# Altium schematic sheet LCD4.3.SchDoc: LCD4.3
size A4; CompanyName: STMicroelectronics; Organization: Microcontrollers Division; DocumentNumber: 16; SheetNumber: 12; SheetTotal: 19
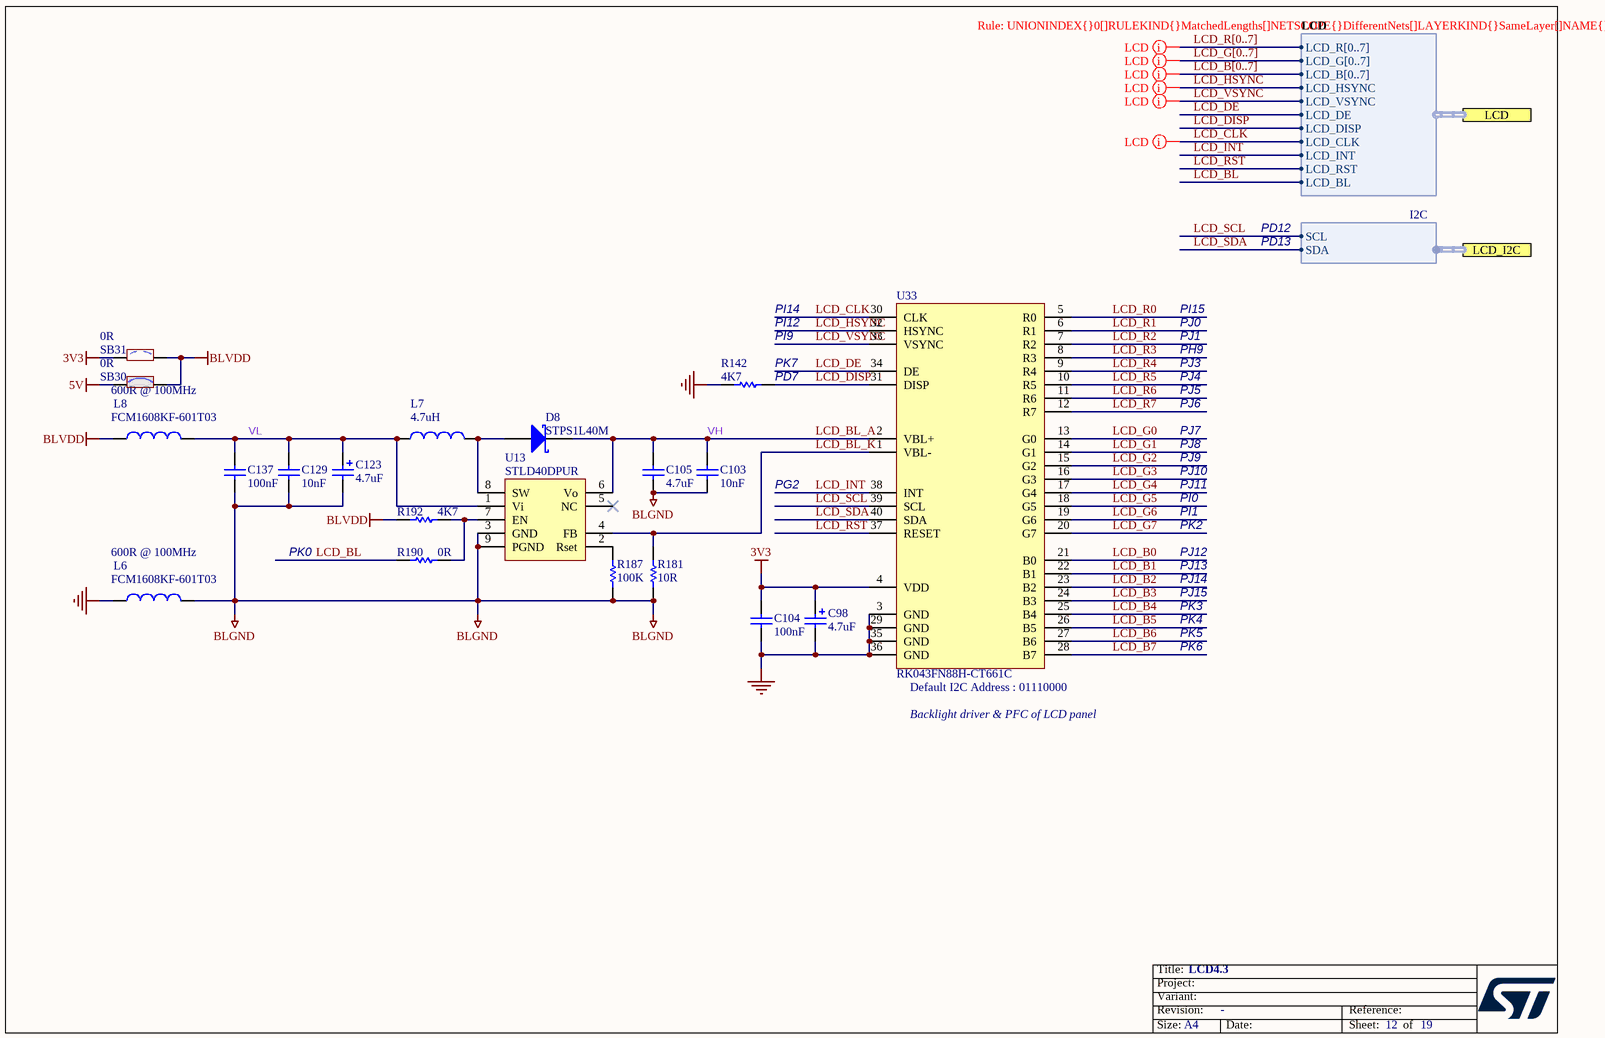
[diagram p0: LCD4.3.SchDoc]

## Parts
C98  value 4.7uF  [CPOL_VISHAY_TANTAL-595D_1407_H220]  (hidden comment: Cap_POL_TANA)
C103  value 10nF  [C0603]  (hidden comment: Capacitor)
C104  value 100nF  [C0402]  (hidden comment: Capacitor)
C105  value 4.7uF  [C1206_H1P25]  (hidden comment: Capacitor)
C123  value 4.7uF  [CPOL_VISHAY_TANTAL-595D_1407_H220]  (hidden comment: Cap_POL_TANA)
C129  value 10nF  [C0603]  (hidden comment: Capacitor)
C137  value 100nF  [C0402]  (hidden comment: Capacitor)
D8  STPS1L40M  [DIO_DO216-AA]
L6  value 600R @ 100MHz  Manufacturer_Part_Number: FCM1608KF-601T03  [L0603]  (hidden comment: BEAD)
L7  value 4.7uH  [L1210_LQH]  (hidden comment: Inductor)
L8  value 600R @ 100MHz  Manufacturer_Part_Number: FCM1608KF-601T03  [L0603]  (hidden comment: BEAD)
R142  value 4K7  [R0603]  (hidden comment: Resistor)
R181  value 10R  [R0805]  (hidden comment: Resistor)
R187  value 100K  [R0402]  (hidden comment: Resistor)
R190  value 0R  [R0603]  (hidden comment: Resistor)
R192  value 4K7  [R0603]  (hidden comment: Resistor)
SB30  value 0R  [SOLDER-BRIDGE_R0603-0R]  (hidden comment: SB_ON)
SB31  value 0R  [SOLDER-BRIDGE_R0603-0R]  (hidden comment: SB_OFF)
U13  STLD40DPUR  [ICC_QFN8-EPAD_3X3_P065]
U33  RK043FN88H-CT661C  [LCD_ROCKTEK_RK043FN48H-CT672B_40P_P080_FLEX-FOLDED]

## Ports
LCD (harness LCD), LCD_I2C (harness I2C)

## Harnesses
LCD: LCD_R[0..7], LCD_G[0..7], LCD_B[0..7], LCD_HSYNC, LCD_VSYNC, LCD_DE, LCD_DISP, LCD_CLK, LCD_INT, LCD_BL, LCD_RST
I2C: SDA, SCL

## Nets
3V3: C98.1 C104.2 SB31.1 U33.4(VDD)
5V: SB30.1
BLGND: C103.1 C105.1 C123.2 C129.1 C137.1 L6.2 R181.1 R187.1 U13.3(GND) U13.9(PGND)
BLVDD: L8.1 R192.1 SB30.2 SB31.2
GND: C98.2 C104.1 L6.1 R142.1 U33.3(GND) U33.29(GND) U33.35(GND) U33.36(GND)
LCD_B0: U33.21(B0)
LCD_B1: U33.22(B1)
LCD_B2: U33.23(B2)
LCD_B3: U33.24(B3)
LCD_B4: U33.25(B4)
LCD_B5: U33.26(B5)
LCD_B6: U33.27(B6)
LCD_B7: U33.28(B7)
LCD_BL: R190.1 ; port LCD.LCD_BL
LCD_BL_A: C103.2 C105.2 D8.2(K) U13.6(Vo) U33.2(VBL+)  [also labelled VH]
LCD_BL_K: R181.2 U13.4(FB) U33.1(VBL-)
LCD_CLK: U33.30(CLK) ; port LCD.LCD_CLK
LCD_DE: U33.34(DE) ; port LCD.LCD_DE
LCD_DISP: R142.2 U33.31(DISP) ; port LCD.LCD_DISP
LCD_G0: U33.13(G0)
LCD_G1: U33.14(G1)
LCD_G2: U33.15(G2)
LCD_G3: U33.16(G3)
LCD_G4: U33.17(G4)
LCD_G5: U33.18(G5)
LCD_G6: U33.19(G6)
LCD_G7: U33.20(G7)
LCD_HSYNC: U33.32(HSYNC) ; port LCD.LCD_HSYNC
LCD_INT: U33.38(INT) ; port LCD.LCD_INT
LCD_R0: U33.5(R0)
LCD_R1: U33.6(R1)
LCD_R2: U33.7(R2)
LCD_R3: U33.8(R3)
LCD_R4: U33.9(R4)
LCD_R5: U33.10(R5)
LCD_R6: U33.11(R6)
LCD_R7: U33.12(R7)
LCD_RST: U33.37(RESET) ; port LCD.LCD_RST
LCD_SCL: U33.39(SCL) ; port LCD_I2C.SCL
LCD_SDA: U33.40(SDA) ; port LCD_I2C.SDA
LCD_VSYNC: U33.33(VSYNC) ; port LCD.LCD_VSYNC
VL: C123.1 C129.2 C137.2 L7.1 L8.2 U13.1(Vi)
NetD8_1: D8.1(A) L7.2 U13.8(SW)
NetR187_2: R187.2 U13.2(Rset)
NetR190_2: R190.2 R192.2 U13.7(EN)

Not connected (* = marked no-connect by the designer): U13 5(NC)*

## Buses and harness runs
bus LCD_B[0..7]
bus LCD_G[0..7]
bus LCD_R[0..7]

## Layout directives
rule Matched Net Lengths [Tolerance = 100mil]: (no net found under the mark), LCD_CLK, LCD_HSYNC, LCD_VSYNC

## Notes on the sheet
- PD13
- PD12
- PI14
- PI15
- (near R142) PI9
- PI12
- (near R142) PD7
- (near R142) PK7
- PJ0
- PJ1
- PH9
- PJ3
- PJ4
- PJ5
- PJ6
- PJ7
- PJ8
- PG2
- PJ9
- PJ10
- PJ11
- PI0
- PI1
- PK0
- PK2
- PJ12
- PJ13
- PJ14
- PJ15
- PK3
- PK4
- PK5
- PK6
- Backlight driver & PFC of LCD panel
- (near U33) Default I2C Address : 01110000
- Title:
- Project:
- Size:
- Revision:
- Variant:
- A4
- -
- Date:
- Reference:
- Sheet:
- of

## Library data of the parts
C98 C123 = MCD-00595: Capacitor, Tantalum, 4.7uF, 16V, +/-10%, 595D case A; Manufacturer_Part_Number: 595D475X9016A2T; Manufacturer: VISHAY; Part_Preference: Recommended; Order_Code_RS: 117-303; Provided_By: Subcon; Initial_Board_Reference: MB1331; Component_Country_Of_Origin: Israel; ID: 3146; ShowFields: YES; Revision: July-2002: Re-released for DXP Platform.; Internal_Part_Number: MCD-00595; Status: Released; Part_Type: Capacitor; ComponentLink1Description: VISHAY_CAPACITOR_TANTALUM_595D.pdf; ComponentLink1URL: http://tunmcdsvn.tun.st.com/Component_Documentation_Library/Trunk/Capacitor/VISHAY_595D_Series; Order_Code_Digikey: 595D475X9016A2T-ND; Order_Code_Farnell: 1166805; Package: 3718 (metric)
C103 C129 = MCD-00017: Capacitor, MLCC, 10nF, 50V, X7R, +/-10%, 0603, T=0.8mm; Manufacturer_Part_Number: CC0603KRX7R9BB103; Manufacturer: YAGEO; Part_Preference: Recommended; Component_Country_Of_Origin: China; ID: 2500; Order_Code_RS: 722236; ShowFields: YES; Internal_Part_Number: MCD-00017; Status: Released; Part_Type: Capacitor; Package: 0603; ComponentLink1URL: http://tunmcdsvn.tun.st.com/Component_Documentation_Library/Trunk/Capacitor/YAGEO_X7R_Series; Order_Code_Digikey: 311-1085-1-ND; Order_Code_Farnell: 722236
C104 C137 = MCD-00006: Capacitor, MLCC, 100nF, 16V, X7R, +/-10%, 0402, T=0.5mm; Manufacturer_Part_Number: CC0402KRX7R7BB104; Manufacturer: YAGEO; Part_Preference: Recommended; Partial_Alternate_Internal_Part_Number: MCD-03299; Component_Country_Of_Origin: China; ID: 2474; Order_Code_RS: 9402047; ShowFields: YES; Internal_Part_Number: MCD-00006; Status: Released; Part_Type: Capacitor; Package: 0402; ComponentLink1URL: http://tunmcdsvn.tun.st.com/Component_Documentation_Library/Trunk/Capacitor/YAGEO_X7R_Series; Order_Code_Digikey: 311-1338-1-ND; Order_Code_Farnell: 9402047
C105 = MCD-00013: Capacitor, MLCC, 4.7uF, 50V, X7R, 10%, 1206, T=1,27mm; Manufacturer_Part_Number: 12065C475KAT2A; Manufacturer: AVX; Part_Preference: Recommended; Provided_By: Subcon; Initial_Board_Reference: MB1274; Component_Country_Of_Origin: China, Malaysia; ID: 2466; Order_Code_RS: 1908177; ShowFields: YES; Internal_Part_Number: MCD-00013; Status: Released; Part_Type: Capacitor; Package: 1206; ComponentLink1Description: AVX_Capacitor_C0G-NP0-series.pdf; ComponentLink1URL: http://tunmcdsvn.tun.st.com/Component_Documentation_Library/Trunk/Capacitor/AVX_X7R_Series; ECCN_US: n/a; ECCN_EU: n/a; Order_Code_Digikey: 478-6653-1-ND; Order_Code_Farnell: 1908177
D8 = MCD-00033: Low Drop power Schottky rectifier(1A, 40V, 0.4V); Part_Type: Diode; Manufacturer: STMICROELECTRONICS; BMS_Part_Number: 9151085; Manufacturer_HQ_COO: EU; Part_Preference: Forbidden; ECCN_US: EAR99; ECCN_EU: NEC; Provided_By: Subcon; Initial_Board_Reference: MB1274; Component_Country_Of_Origin: China; ID: 2485; Order_Code_RS: 189-4505; ShowFields: YES; Internal_Part_Number: MCD-00033; Value: STPS1L40M; Status: Released; Manufacturer_Part_Number: STPS1L40M; ComponentLink1Description: STM_Diode_STPS1L40M_DO216-AA.pdf; ComponentLink1URL: http://tunmcdsvn.tun.st.com/Component_Documentation_Library/Trunk/Diode/STMICROELECTRONICS_STPS1L40M; Order_Code_Digikey: 497-3212-2-ND; Order_Code_Farnell: 2629693; Package: DO216-AA
L6 L8 = MCD-00047: Ferrite bead, 600R @1 00MHz, +/-25%, 350mA, 0R5, 0603, T=0.8mm; Part_Type: Inductor; Manufacturer: TAI-TECH; Part_Preference: Recommended; Partial_Alternate_Internal_Part_Number: MCD-02959; Component_Country_Of_Origin: Unknown; ID: 2546; ShowFields: YES; Internal_Part_Number: MCD-00047; Status: Released; ComponentLink1URL: http://tunmcdsvn.tun.st.com/Component_Documentation_Library/Trunk/Inductor/TAI-TECH_FCM-1608_Series; Order_Code_Digikey: N/A; Order_Code_Farnell: N/A; Order_Code_RS: N/A; Package: 0603
L7 = MCD-00048: FIXED IND 4.7UH 1A 180 MOHM 30% SMD; Manufacturer_Part_Number: LQH32PN4R7NN0L; Manufacturer: MURATA; Part_Preference: Recommended; Provided_By: Subcon; Initial_Board_Reference: MB1274; Component_Country_Of_Origin: Japan°°; ID: 2544; Order_Code_RS: 2470296; ShowFields: YES; Internal_Part_Number: MCD-00048; Status: Released; Part_Type: Inductor; ComponentLink1Description: Murata_Inductor_LQH32PN4R7NN0L.pdf; ComponentLink1URL: http://tunmcdsvn.tun.st.com/Component_Documentation_Library/Trunk/Inductor/MURATA_LQH32PN4R7NN0; ECCN_US: n/a; ECCN_EU: n/a; Order_Code_Digikey: 490-5338-2-ND; Order_Code_Farnell: 2470296; Package: 1210
R142 R192 = MCD-00219: Resistor,4K7,0603,1%,1/10W; Manufacturer_Part_Number: RC0603FR-074K7L; Manufacturer: YAGEO; Part_Preference: Recommended; Provided_By: Subcon; Initial_Board_Reference: mb1319; Component_Country_Of_Origin: China; ID: 2648; ShowFields: YES; Internal_Part_Number: MCD-00219; Status: Released; Part_Type: Resistor; Package: 0603; ComponentLink1Description: Yageo_Resistor_RC0603-series.pdf; ComponentLink1URL: http://tunmcdsvn.tun.st.com/Component_Documentation_Library/Trunk/Resistor/YAGEO_RC_L_Series; ECCN_US: n/a; ECCN_EU: n/a; Order_Code_Digikey: 311-4.70KHRCT-ND; Order_Code_Farnell: 9238565; Order_Code_RS: N/A
R181 = MCD-01111: Resistor,10R,0805,1%,Stackpole,1/4W; Manufacturer_Part_Number: RNCP0805FTD10R0; Part_Preference: Recommended; Provided_By: Subcon; Initial_Board_Reference: MB1381; Component_Country_Of_Origin: Taiwan°; ID: 3385; ShowFields: YES; Internal_Part_Number: MCD-01111; Status: Released; Part_Type: Resistor; Manufacturer: STACKPOLE; Package: 0805; ComponentLink1Description: Stackpole_Resisteor_RNCP Series.pdf; ComponentLink1URL: http://tunmcdsvn.tun.st.com/Component_Documentation_Library/Trunk/Resistor/STACKPOLE_RNCP_Series; ECCN_US: n/a; ECCN_EU: n/a; Order_Code_Digikey: RNCP0805FTD10R0CT-ND; Order_Code_Farnell: N/A; Order_Code_RS: N/A
R187 = MCD-00059: Resistor,100K,0402,1%,1/16W; Manufacturer_Part_Number: RC0402FR-07100KL; Manufacturer: YAGEO; Alternate_Manufacturer_Part_Number: RT0402FRE07100KL; Part_Preference: Recommended; Partial_Alternate_Internal_Part_Number: MCD-03301; Provided_By: Subcon; Initial_Board_Reference: MB1274; Component_Country_Of_Origin: China; ID: 2533; Order_Code_RS: 2421891; ShowFields: YES; Internal_Part_Number: MCD-00059; Status: Released; Part_Type: Resistor; Alternate_Manufacturer: YAGEO; Package: 0402; ComponentLink1Description: Yageo_Resistor_RC0402-series.pdf; ComponentLink1URL: http://tunmcdsvn.tun.st.com/Component_Documentation_Library/Trunk/Resistor/YAGEO_RC_L_Series; ECCN_US: n/a; ECCN_EU: n/a; Order_Code_Digikey: 311-100KLRTR-ND; Order_Code_Farnell: 2421891
R190 = MCD-00181: Resistor,0R,0603,ULO; Manufacturer_Part_Number: PMR03EZPJ000; Manufacturer: ROHM SEMICONDUCTOR; Part_Preference: Recommended; Provided_By: Subcon; Component_Country_Of_Origin: Philippines, Thailand°°; ID: 2691; ShowFields: YES; Internal_Part_Number: MCD-00181; Status: Released; Part_Type: Resistor; Package: 0603; ComponentLink1Description: ROHM_ULtra low Ohmic Resistor _PMR10EZPJ000.pdf; ComponentLink1URL: http://tunmcdsvn.tun.st.com/Component_Documentation_Library/Trunk/Resistor/ROHM_PMR_Series; ECCN_US: n/a; ECCN_EU: n/a; Order_Code_Digikey: PMR03EZPJ000-ND; Order_Code_Farnell: N/A; Order_Code_RS: N/A
SB30 = MCD-00071: Solder Bridge ON; Part_Type: Resistor; Manufacturer: YAGEO; Manufacturer_HQ_COO: Unknown; Manufacturer_Part_Number: RC0603JR-070RL; Part_Preference: Recommended; Provided_By: Subcon; Initial_Board_Reference: mb1274; Component_Country_Of_Origin: China; ID: 2521; Order_Code_RS: 199-5647; ShowFields: YES; Internal_Part_Number: MCD-00071; ECCN_US: n/a; ECCN_EU: n/a; Status: Released; ComponentLink1URL: http://tunmcdsvn.tun.st.com/Component_Documentation_Library/Trunk/Resistor/YAGEO_RC_Series; Order_Code_Digikey: 311-0.0GRTR-ND; Order_Code_Farnell: 2421846; Package: 0603
SB31 = MCD-00072: Solder Bridge OFF; Part_Type: Resistor; Manufacturer: YAGEO; Manufacturer_HQ_COO: Unknown; Manufacturer_Part_Number: RC0603JR-070RL; Part_Preference: Recommended; Initial_Board_Reference: mb1274; Component_Country_Of_Origin: China; ID: 2520; Order_Code_RS: 199-5647; ShowFields: YES; Internal_Part_Number: MCD-00072; Status: Released; ECCN_US: n/a; ECCN_EU: n/a; Provided_By: n/a; ComponentLink1URL: http://tunmcdsvn.tun.st.com/Component_Documentation_Library/Trunk/Resistor/YAGEO_RC_Series; Order_Code_Digikey: 311-0.0GRTR-ND; Order_Code_Farnell: 2421846; Package: 0603
U13 = MCD-00082: White LED power supply for large display backlight, QFN8; Part_Type: IC; Manufacturer: STMICROELECTRONICS; BMS_Part_Number: 9176009; Manufacturer_HQ_COO: EU; Part_Preference: Recommended; ECCN_US: EAR99; ECCN_EU: NEC; Provided_By: Subcon; Initial_Board_Reference: MB1274; Component_Country_Of_Origin: Malaysia; ID: 2510; Order_Code_RS: 188-9216; ShowFields: YES; Internal_Part_Number: MCD-00082; Value: STLD40DPUR; Status: Released; Manufacturer_Part_Number: STLD40DPUR; ComponentLink1Description: STM_White-LED-PWR_STLD40DPUR_QFN8.pdf; ComponentLink1URL: http://tunmcdsvn.tun.st.com/Component_Documentation_Library/Trunk/IC/STMICROELECTRONICS_STLD40DPUR; Order_Code_Digikey: 497-8927-2-ND; Order_Code_Farnell: 3129823; Package: QFN-8
U33 = MCD-03909: LCD, TFT, 4.3-inch, 480(RGB)x272 pixels; Part_Type: Display; Part_Preference: Recommended; Manufacturer: ROCKTECH; Component_Country_Of_Origin: Unknown; ShowFields: YES; ID: 6025; Value: RK043FN88H-CT661C; Order_code_Digikey: N/A; Order_code_Farnell: N/A; Order_code_RS: N/A; Status: Checked; ComponentLink1URL: http://tunmcdsvn.tun.st.com/Component_Documentation_Library/Trunk/Display/ROCKTECH_RK043FN88H-CT661C; Internal_Part_Number: MCD-03909; Manufacturer_Part_Number: RK043FN88H-CT661C; Package: 67.2x105.5x4.53mm